# Altium schematic sheet TK514_Interrupter.SchDoc: TK514 Interrupter
size A4; PageSetup: Record=PageOptions|CenterHorizontal=False|CenterVertical=False|PrintScale=0.97|XCorrection=1.00|YCorrection=1.00|PrintKind=1|BorderSize=5000000|LeftOffset=0|BottomOffset=0|Orientation=2|PaperLength=1000|PaperWidth=1000|Scale=100|PaperSource=7|PrintQuality=-4|MediaType=1|DitherType=10|PaperKind=A4|PrintScaleMode=1; Author: Øystein Smith; Organization: Omega Verksted; DocumentNumber: 8; Revision: 0; SheetNumber: 8; SheetTotal: 20
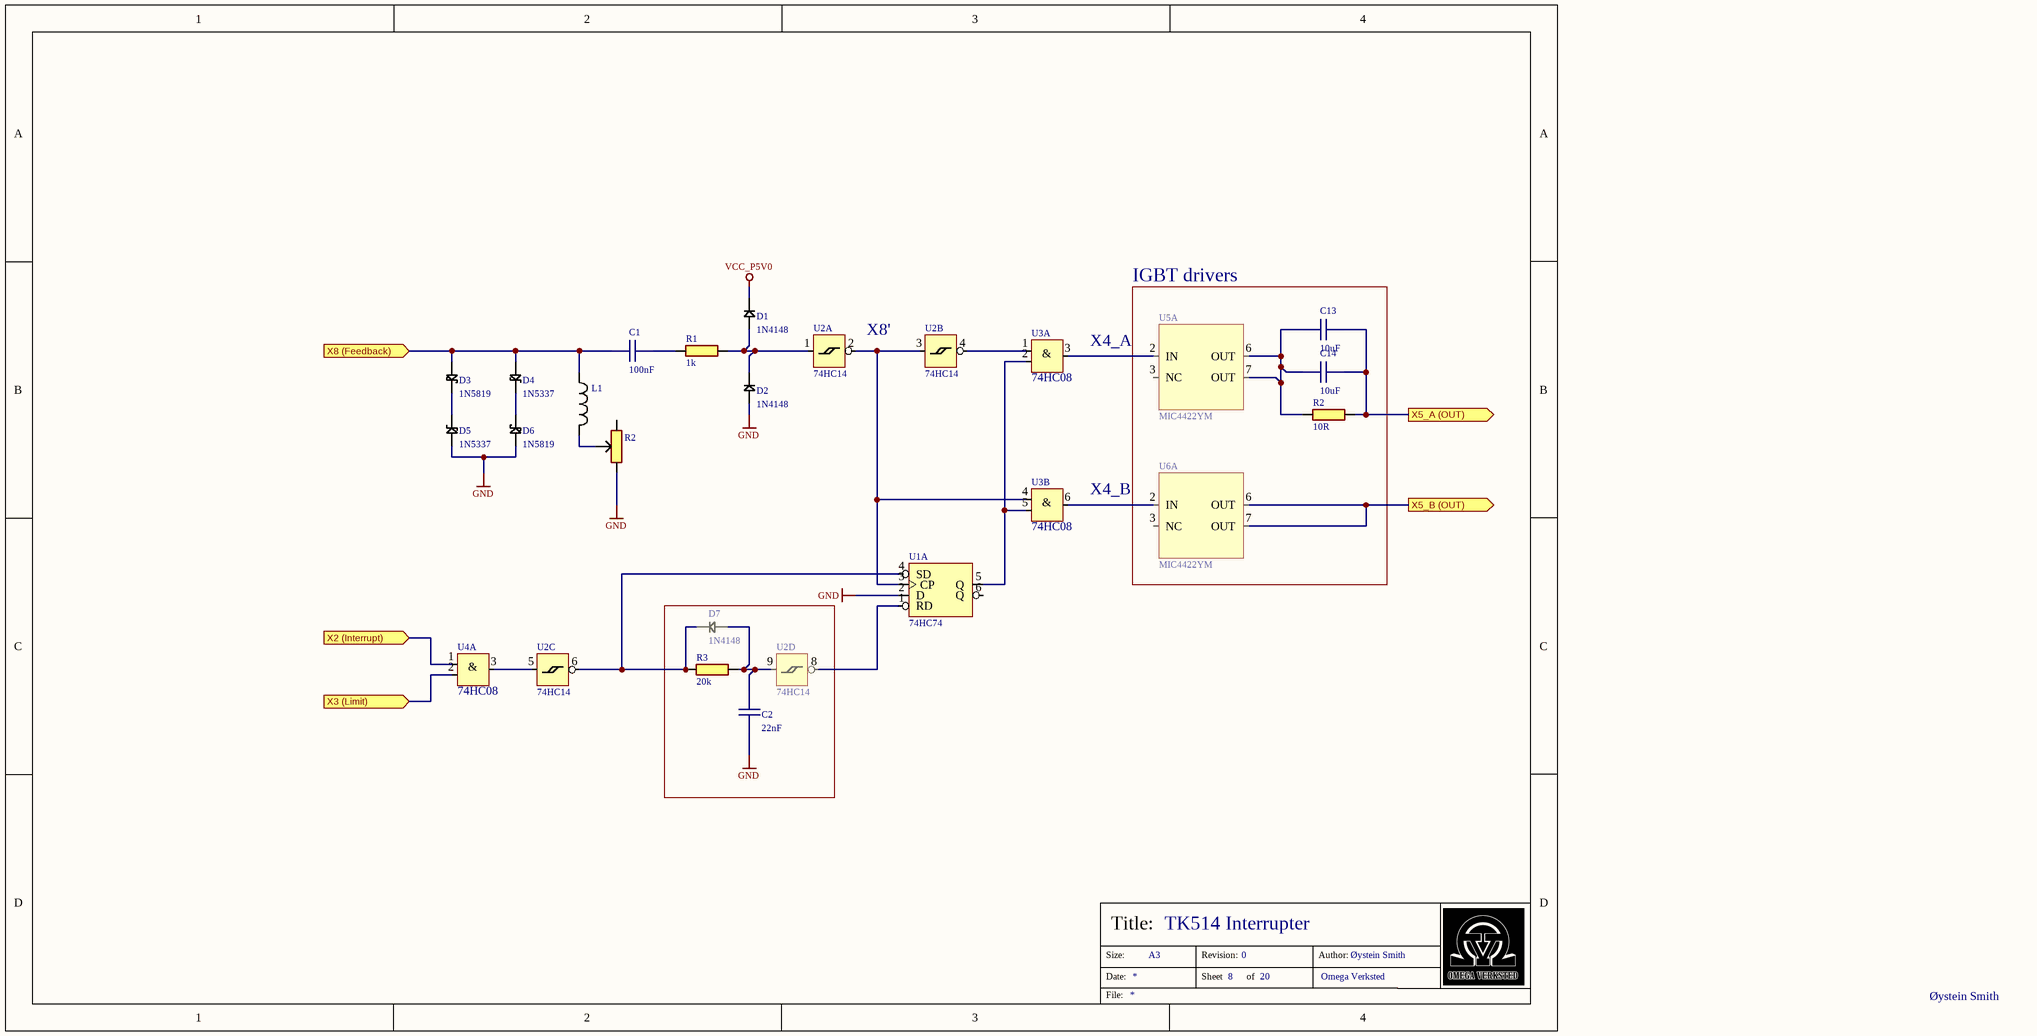
[diagram p0: TK514_Interrupter.SchDoc]

## Parts
(Parts that share a designator on the sheet are numbered #1, #2 ... from top to bottom, then left to right.)
C1  100nF  [CAPC0603(1608)55_N]
C2  22nF  [CAPC0805(2012)100_N]
C13  10uF  [CAPC1206(3216)170_N]
C14  10uF  [CAPC1206(3216)170_N]
D1  1N4148  [I_DIOC0805X03]
D2  1N4148  [I_DIOC0805X03]
D3  1N5819  [DO-41]
D4  1N5337  [DO-29]
D5  1N5337  [DO-29]
D6  1N5819  [DO-41]
D7  1N4148  [I_DIOC0805X03]
L1  SMD spoler  [INDP3225X20N]  (value not drawn)
R1  1k  [RESC0603(1608)_N]
R2#1  10R  [RESC0805(2012)_N]
R2#2  Trimmepot 100ohm  [TRIMPOT_3006P]  (value not drawn)
R3  20k  [RESC0603(1608)_N]
U1  74HC74  [SOIC-14]  (part A of 3)
U2  74HC14  [SOIC-14]  (parts A,B,C,D of 7)
U3  74HC08  [SOIC-14]  (parts A,B of 5)
U4  74HC08  [SOIC-14]  (part A of 5)
U5  MIC4422YM  [SOIC-8-WIDE]  (part A of 2)
U6  MIC4422YM  [SOIC-8-WIDE]  (part A of 2)

## Blocks framed on the sheet
IGBT drivers: C13 C14 R2#1 U5 U6

## Ports
X2 (Interrupt) (in), X3 (Limit) (in), X5_A (OUT) (out), X5_B (OUT) (out), X8 (Feedback) (in)

## Nets
GND: C2.1 D2.1(A) D5.1(A) D6.1(A) R2#2.1 U1.2(D)
VCC_P5V0: D1.2(K)
X2 (Interrupt): U4.1 ; port X2 (Interrupt)
X3 (Limit): U4.2 ; port X3 (Limit)
X5_A (OUT): C13.2 C14.2 R2#1.2 ; port X5_A (OUT)
X5_B (OUT): U6.6(OUT) U6.7(OUT) ; port X5_B (OUT)
X8 (Feedback): C1.1 D3.1(A) D4.1(A) L1.1 ; port X8 (Feedback)
NetC1_2: C1.2 R1.1
NetC2_2: C2.2 D7.1(A) R3.2 U2.9
NetC13_1: C13.1 C14.1 R2#1.1 U5.6(OUT) U5.7(OUT)
NetD1_1: D1.1(A) D2.2(K) R1.2 U2.1
NetD3_2: D3.2(K) D5.2(K)
NetD4_2: D4.2(K) D6.2(K)
NetD7_2: D7.2(K) R3.1 U1.4(SD) U2.6
NetL1_2: L1.2 R2#2.2
NetU1_1: U1.1(RD) U2.8
NetU1_3: U1.3(CP) U2.2 U2.3 U3.4
NetU1_5: U1.5(Q) U3.2 U3.5
NetU2_4: U2.4 U3.1
NetU2_5: U2.5 U4.3
NetU3_3: U3.3 U5.2(IN)
NetU3_6: U3.6 U6.2(IN)

Not connected (* = marked no-connect by the designer): R2#2 3; U1 6(Q); U5 3(NC); U6 3(NC)

## Notes on the sheet
- (near U2) X8'
- X4_A
- X4_B
- Øystein Smith
- Size:
- Date:
- Title:
- A3
- Revision:
- Sheet
- of
- Author:
- File:
- (in symbol 1954, part A) &
- (in symbol 1954, part B) &

## Library data of the parts
C1 = 3028: X7R 50V 5%; id: 3028; pakke_opprettet_av: 815; pakke_opprettet: 18.02.2015 14.18.13; symbol_opprettet: 14.11.2014 20.19.34; leverandor_varenr: 1759122; pris: 1; nokkelord: Kondensator, Capacitor, CAP; produsent: Multikomp; leverandor: Farnell; pakketype: 0603; symbol_opprettet_av: 815; navn: 100nF
C2 = 2446: X7R; id: 2446; pakke_opprettet_av: 815; pakke_opprettet: 14.11.2014 20.52.01; symbol_opprettet: 14.11.2014 20.19.34; pris: 1; nokkelord: Capacitor Cap Kondis; pakketype: 0805; symbol_opprettet_av: 815; navn: 22nF
C13 C14 = 3583: X5R 50V 10%; id: 3583; pakke_opprettet_av: 815; pakke_opprettet: 11.02.2015 13.21.22; symbol_opprettet: 14.11.2014 20.19.34; leverandor_varenr: 1845762; pris: 6; nokkelord: Kondensator, capacitor; produsent: Murata; leverandor: Farnell; pakketype: 1206; symbol_opprettet_av: 815; navn: 10uF
D1 D2 D7 = 2366: id: 2366; rad: 3; rom: OV; lager_type: Fremlager; dybde: 0; hylle: 6; antall: 100; pakke_opprettet_av: 815; pakke_opprettet: 28.06.2014 16.05.35; symbol_opprettet: 28.06.2014 15.10.17; beskrivelse: SMD signaldiode; leverandor_varenr: 8150206; pris: 1; produsent: Taiwan Semiconductor; leverandor: Farnell; pakketype: 0805; kolonne: 0; symbol_opprettet_av: 815; navn: 1N4148
D3 D6 = 2369: id: 2369; rad: 0; rom: OV; lager_type: Fremlager; hylle: 6; antall: 1; kolonne: 2; pakke_opprettet_av: 815; pakke_opprettet: 28.06.2014 16.50.18; symbol_opprettet: 28.06.2014 15.20.09; beskrivelse: Schottkydiode, 1A, 40V; leverandor_varenr: 7429304; nokkelord: schottky, diode; produsent: Multikomp; leverandor: Farnell; pakketype: DO; dybde: 0; symbol_opprettet_av: 815; navn: 1N5819; pris: 2
D4 D5 = 2368: id: 2368; pakke_opprettet_av: 815; pakke_opprettet: 28.06.2014 16.16.55; symbol_opprettet: 28.06.2014 15.11.05; beskrivelse: Zenerdiode 4.7V 5W; leverandor_varenr: 1N5337BGOS-ND; pris: 5; produsent: ON Semiconductor; leverandor: DigiKey; pakketype: DO; symbol_opprettet_av: 815; navn: 1N5337
L1 = 1739: SMD inductors og tomme SMD bokser; id: 1739; pakke_opprettet_av: 924; pakke_opprettet: 26.05.2015 23.51.10; symbol_opprettet: 27.05.2015 00.20.21; pris: -1; symbol_opprettet_av: 924; navn: SMD spoler; pakketype: SMD
R1 = 3029: 0.1W 1% Thick film resistor; id: 3029; pakke_opprettet_av: 815; pakke_opprettet: 08.07.2014 21.15.30; symbol_opprettet: 08.07.2014 21.16.33; leverandor_varenr: 2447272; pris: 0; nokkelord: Resistor Motstand; produsent: Multikomp; leverandor: Farnell; pakketype: 0603; symbol_opprettet_av: 815; navn: 1k
R2#1 = 3585: 0.1W 1% Thick film resistor; id: 3585; pakke_opprettet_av: 815; pakke_opprettet: 27.01.2016 14.23.16; symbol_opprettet: 08.07.2014 21.16.33; pris: 0; nokkelord: Resistor Motstand; produsent: Multikomp; pakketype: 0805; symbol_opprettet_av: 815; navn: 10R
R2#2 = 3514: 15 turn, horizontal; id: 3514; rad: 1; rom: OV; lager_type: Fremlager; dybde: 0; hylle: 7; antall: 54; pakke_opprettet_av: 815; pakke_opprettet: 10.02.2017 15.29.47; symbol_opprettet: 03.11.2016 15.34.07; leverandor_varenr: 9352279; pris: 15; nokkelord: trimpot; produsent: Bourns; leverandor: Farnell; pakketype: TH; kolonne: 1; symbol_opprettet_av: 815; navn: Trimmepot 100ohm
R3 = 3471: 0.1W 1% Thick film resistor; id: 3471; rad: -1; rom: OV; lager_type: Fremlager; dybde: 79; hylle: 6; antall: 100; kolonne: 0; pakke_opprettet_av: 815; pakke_opprettet: 08.07.2014 21.15.30; symbol_opprettet: 08.07.2014 21.16.33; pakketype: 0603; symbol_opprettet_av: 815; navn: 20k; pris: 0
U1 = 2373: id: 2373; pakke_opprettet_av: 815; pakke_opprettet: 28.06.2014 18.13.44; symbol_opprettet: 28.06.2014 15.25.05; beskrivelse: Dual D flip flop; leverandor_varenr: 9591680; pris: 4; nokkelord: Logikk; produsent: Texas Instruments; leverandor: Farnell; pakketype: SOIC; symbol_opprettet_av: 815; navn: 74HC74
U2 = 2372: id: 2372; pakke_opprettet_av: 815; beskrivelse: Hex Schmitt trigger; leverandor_varenr: 1607772; pris: 4; nokkelord: Logikk; produsent: ON Semiconductor; leverandor: Farnell; pakketype: SOIC; pakke_opprettet: 28.06.2014 18:13:44; symbol_opprettet_av: 815; symbol_opprettet: 28.06.2014 15:23:38; navn: 74HC14
U3 U4 = 1954: id: 1954; rad: 0; rom: OV; lager_type: Fremlager; dybde: 3; hylle: 13; antall: 51; kolonne: 2; pakke_opprettet_av: 815; beskrivelse: Quad And Gate; leverandor_varenr: 9590986; produsent: Toshiba; leverandor: Farnell; pakketype: SOIC; pakke_opprettet: 28.06.2014 18:13:44; symbol_opprettet_av: 815; symbol_opprettet: 28.06.2014 15:22:08; navn: 74HC08; pris: 3
U5 U6 = 2378: Mosfet Driver; id: 2378; pakke_opprettet_av: 815; pakke_opprettet: 28.06.2014 18.39.37; symbol_opprettet: 28.06.2014 15.39.18; leverandor_varenr: 1517245; pris: 20; produsent: Micrel Semiconductor; leverandor: Farnell; pakketype: SOIC; symbol_opprettet_av: 815; navn: MIC4422YM